# Altium schematic sheet P1.schdoc
size 297 x 209 mm; Symbol: Drawing-Symbol_A4; Company: 嘉立创EDA; Version: V1.0; Page Size: A4; @Project Name: 40Hz音箱; @Update Date: 2026-01-13; @Create Date: 2026-01-13; Device: Drawing-Symbol_A4; @Board Name: Board1; @Page Name: P1; @Create Time: 10:26:32; @Page Count: 1; @Page No: 1; @Schematic Name: Schematic1; @Update Time: 10:26:32; @Assembly Variant: Basic; Border: 1; Title Block Position: 3; Size: A4; Width: 1170; Height: 825; Region Start: 1; X Region Count: 6; Y Region Count: 4; Blade Width: 10
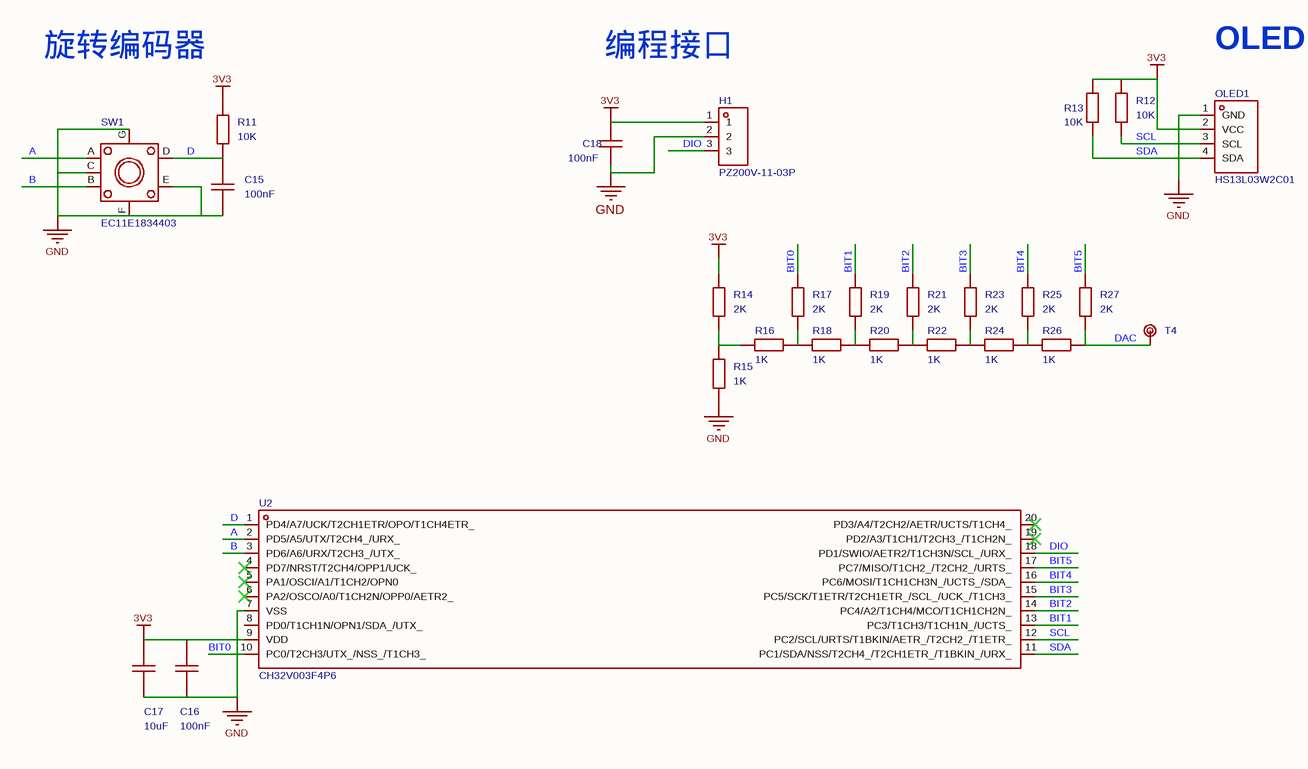
[diagram p0: P1.schdoc]

## Parts
C15  100nF  [C0603]
C16  100nF  [C0603]
C17  10uF  [C0603]
C18  100nF  [C0603_1]
H1  PZ200V-11-03P  [HDR-TH_3P-P2.00-V-M]
OLED1  HS13L03W2C01  [OLED-TH_L35.4-W33.5_HS13L03W2C01]
R11  10K  [R0603]
R12  10K  [R0603]
R13  10K  [R0603]
R14  2K  [R0603]
R15  1K  [R0603]
R16  1K  [R0603]
R17  2K  [R0603]
R18  1K  [R0603]
R19  2K  [R0603]
R20  1K  [R0603]
R21  2K  [R0603]
R22  1K  [R0603]
R23  2K  [R0603]
R24  1K  [R0603]
R25  2K  [R0603]
R26  1K  [R0603]
R27  2K  [R0603]
SW1  EC11E1834403  [SW-TH_EC11E1820402]
T4  GND  [TP-TH-1.5mm]  (value not drawn)
U2  CH32V003F4P6  [TSSOP-20_L6.5-W4.4-P0.65-LS6.4-BL]

## Nets
3V3: C16.2 C17.2 C18.2 H1.1 OLED1.2(VCC) R11.2 R12.2 R13.2 R14.2 U2.9(VDD)
GND: C15.1 C16.1 C17.1 C18.1 H1.2 OLED1.1(GND) R15.1 SW1.C SW1.E SW1.F SW1.G U2.7(VSS)
A: SW1.A U2.2(PD5/A5/UTX/T2CH4_/URX_)
B: SW1.B U2.3(PD6/A6/URX/T2CH3_/UTX_)
BIT0: R17.2 U2.10(PC0/T2CH3/UTX_/NSS_/T1CH3_)
BIT1: R19.2 U2.13(PC3/T1CH3/T1CH1N_/UCTS_)
BIT2: R21.2 U2.14(PC4/A2/T1CH4/MCO/T1CH1CH2N_)
BIT3: R23.1 U2.15(PC5/SCK/T1ETR/T2CH1ETR_/SCL_/UCK_/T1CH3_)
BIT4: R25.2 U2.16(PC6/MOSI/T1CH1CH3N_/UCTS_/SDA_)
BIT5: R27.2 U2.17(PC7/MISO/T1CH2_/T2CH2_/URTS_)
D: C15.2 R11.1 SW1.D U2.1(PD4/A7/UCK/T2CH1ETR/OPO/T1CH4ETR_)
DAC: R26.1 R27.1 T4.1
DIO: H1.3 U2.18(PD1/SWIO/AETR2/T1CH3N/SCL_/URX_)
SCL: OLED1.3(SCL) R12.1 U2.12(PC2/SCL/URTS/T1BKIN/AETR_/T2CH2_/T1ETR_)
SDA: OLED1.4(SDA) R13.1 U2.11(PC1/SDA/NSS/T2CH4_/T2CH1ETR_/T1BKIN_/URX_)
NetR14_1: R14.1 R15.2 R16.1
NetR16_2: R16.2 R17.1 R18.1
NetR18_2: R18.2 R19.1 R20.1
NetR20_2: R20.2 R21.1 R22.2
NetR22_1: R22.1 R23.2 R24.1
NetR24_2: R24.2 R25.1 R26.2

Not connected (* = marked no-connect by the designer): U2 4(PD7/NRST/T2CH4/OPP1/UCK_)* 5(PA1/OSCI/A1/T1CH2/OPN0)* 6(PA2/OSCO/A0/T1CH2N/OPP0/AETR2_)* 8(PD0/T1CH1N/OPN1/SDA_/UTX_) 19(PD2/A3/T1CH1/T2CH3_/T1CH2N_)* 20(PD3/A4/T2CH2/AETR/UCTS/T1CH4_)*

## Notes on the sheet
- 旋转编码器
- 编程接口
- OLED
- 创建日期
- 2026-01-13
- 原理图
- 板子
- Schematic1
- Board1
- 更新日期
- 图页
- P1
- 绘制
- 审阅
- 40Hz音箱
- 版本
- V1.0
- 尺寸
- A4
- 页    1    共    1
- 嘉立创EDA

## Library data of the parts
C15-C17 = CAP_0603: Symbol: Capacitance; 3D Model: ac125912035d415993ca9572d50418b10819f05c4eef4c71ace90d822a990e87; 3D Model Transform: 62.992,31.496,0,0,0,0,0,0,0; ConvertToPcb: yes; ModelName: C0603_L1.6-W0.8-H0.8; Device: CAP_0603; Supplier Footprint: 0603; AddInBom: yes; FootprintName: C0603
  C15 C16: Value: 100nF
  C17: Value: 10uF
C18 = 0603B104K500NT: 容值:100nF;精度:±10%;额定电压:50V;材质(温度系数):X7R;; Manufacturer: FH(风华); 3D Model: ac125912035d415993ca9572d50418b1; 3D Model Transform: 62.992,31.496,0,0,0,0,0,0,0; Tolerance: ±10%; Voltage Rated: 50V; Temperature Coefficient: X7R; AddInBom: yes; ModelName: C0603_L1.6-W0.8-H0.8; Symbol: 0603B104K500NT; Device: 0603B104K500NT; LCSC Part Name: 100nF ±10% 50V; Supplier Footprint: 0603; Datasheet: https://atta.szlcsc.com/upload/public/pdf/source/20200305/C486355_26A10D38EF8C2A5C37091D0039909270.pdf; Supplier: LCSC; Manufacturer Part: 0603B104K500NT; Value: 100nF; Supplier Part: C30926; JLCPCB Part Class: 扩展库; ConvertToPcb: yes; FootprintName: C0603_1
H1 = PZ200V-11-03P: 插针结构:1x3P;间距:2mm;行距:-;圆针/方针:方针;安装类型:直插;排数:单排;总PIN位数:3P;额定电流:-;额定电压:-;配合针长度:3.9mm;塑高:2mm;端接针长度:2.8mm;触头材质:黄铜;触头镀层:-;工作温度范围:-40℃~+105℃;焊接温度(最大值):-;颜色:黑色;; Manufacturer: XFCN(兴飞); 3D Model: 19836629849e400398576ca24f09f804; 3D Model Transform: 236.22,78.74,0,0,0,0,0,0,-118.11; Pin Structure: 1x3P; Pitch: 2mm; Circluar Pins/Square Pins: 方针; AddInBom: yes; ModelName: HDR-TH_3P-P2.00-M-LI-1X3P; Symbol: PZ200V-11-03P; Device: PZ200V-11-03P; LCSC Part Name: 间距:2mm 1x3P 直插 方针; Supplier Part: C541857; Manufacturer Part: PZ200V-11-03P; Supplier Footprint: 插件,P=2mm; JLCPCB Part Class: 扩展库; Datasheet: https://atta.szlcsc.com/upload/public/pdf/source/20200518/C541858_7610F54454E936EFCDE06B655DF7C837.pdf; Supplier: LCSC; Row Spacing: -; Mounting Type: 直插; Number of Rows: 单排; Number of Pins: 3P; Current Rating (Max): -; Voltage Rating (Max): -; Length of Mating Pin: 3.9mm; Insulation Height: 2mm; Length of End Connection Pin: 2.8mm; Contact Material: 黄铜; Contact Plating: -; Operating Temperature Range: -40℃~+105℃; Soldering Temperature(Max): -; Color: 黑色; ConvertToPcb: yes; FootprintName: HDR-TH_3P-P2.00-V-M
OLED1 = HS13L03W2C01: 主控芯片:SH1106;接口类型:I2C;尺寸(inch):1.3;; Manufacturer: HS(汉昇); AddInBom: yes; ModelId: 1d2c7118638a46dba2ecf32a02d5b76d0819f05c4eef4c71ace90d822a990e87; ModelTransform: 1393.69792,1318.895,0,0,0,0,0,-581.298,-196.85; Main Control Chip: SH1106; Interface Type: I2C; Symbol: HS13L03W2C01; Device: HS13L03W2C01; LCSC Part Name: 1.3'1.3寸 128*64 OLED显示屏 I2C通讯 SH1106 白光; SupplierPart: C7465997; ManufacturerPart: HS13L03W2C01; Supplier Footprint: -; JLCPCB Part Class: Extended Part; Datasheet: https://atta.szlcsc.com/upload/public/pdf/source/20230720/8731A47396DED074CDCD72E9ACEFB46F.pdf; Supplier: LCSC; ConvertToPcb: yes; FootprintName: OLED-TH_L35.4-W33.5_HS13L03W2C01; ModelName: OLED-TH_L35.4-W33.5_HS13L03W2C01; Size: 1.3; Operating Temperature: -40℃~+70℃
R11-R27 = Res_0603: Symbol: 电阻; ConvertToPcb: yes; ModelId: fc143cca1e79419f9cd78b61e9279f080819f05c4eef4c71ace90d822a990e87; ModelTransform: 31.8897,63.7794,0,90,0,0,0,0,0; Device: Res_0603; AddInBom: yes; Supplier Footprint: 0603; FootprintName: R0603; ModelName: R0603
  R11-R13: Value: 10K
  R14 R17 R19 R21 R23 R25 R27: Value: 2K
  R15 R16 R18 R20 R22 R24 R26: Value: 1K
SW1 = EC11E1834403: Manufacturer: ALPSALPINE(阿尔卑斯阿尔派); AddInBom: yes; ModelId: b5b497dcae174941b630006fab1516e10819f05c4eef4c71ace90d822a990e87; ModelName: SW-TH_EC11E1820402-L11.7-W12.0-H24.5-P2.5-LS14.5; ModelTransform: 495.18696,578.739,0,0,0,0,0,0,-137.795; Symbol: EC11E1834403; Device: EC11E1834403; LCSC Part Name: 编码器; SupplierPart: C361165; ManufacturerPart: EC11E1834403; Supplier Footprint: 插件; JLCPCB Part Class: Extended Part; Datasheet: https://atta.szlcsc.com/upload/public/pdf/source/20190109/C361167_8025A1363C62EF4BA37C0EA12E1AE3EA.pdf; Supplier: LCSC; ConvertToPcb: yes; FootprintName: SW-TH_EC11E1820402
T4 = 测试孔: AddInBom: yes; Symbol: 测试孔; Device: 测试孔; ConvertToPcb: yes; FootprintName: TP-TH-1.5mm
U2 = CH32V003F4P6: Manufacturer: WCH(南京沁恒); AddInBom: yes; ModelId: c491f68934b34c649df5890a1d97cd0f0819f05c4eef4c71ace90d822a990e87; ModelName: TSSOP-20_L6.5-W4.4-H1.0-LS6.4-P0.65; ModelTransform: 251.969,255.906,0,90,0,0,0.0005,0,0; Symbol: CH32V003F4P6; Device: CH32V003F4P6; LCSC Part Name: QingKe V2微处理器; SupplierPart: C5187096; ManufacturerPart: CH32V003F4P6; Supplier Footprint: TSSOP-20-175mil; JLCPCB Part Class: Extended Part; Datasheet: https://item.szlcsc.com/datasheet/CH32V003F4P6/5858783.html; Supplier: LCSC; ConvertToPcb: yes; FootprintName: TSSOP-20_L6.5-W4.4-P0.65-LS6.4-BL